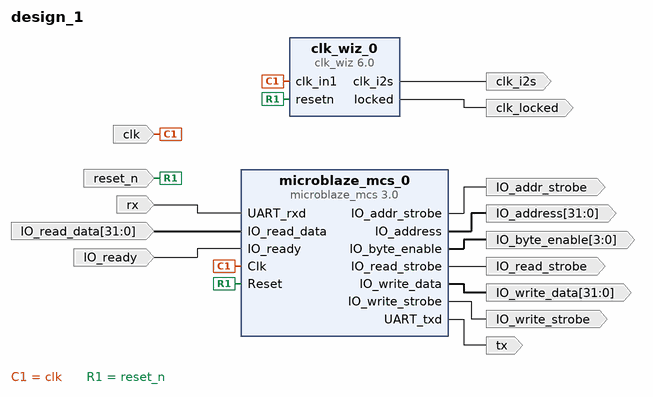
[diagram p0: block diagram of the top level]
# Vivado block design design_1, xc7a35ticsg324-1L, Vivado 2019.1
create_bd_design design_1

create_bd_port -dir I -type clk clk
set_property -dict {CONFIG.ASSOCIATED_RESET reset_n CONFIG.FREQ_HZ 100000000} [get_bd_ports clk]
create_bd_port -dir I -type rst reset_n
create_bd_port -dir I rx
create_bd_port -dir O tx
create_bd_port -dir O IO_addr_strobe
create_bd_port -dir O -from 31 -to 0 IO_address
create_bd_port -dir O -from 3 -to 0 IO_byte_enable
create_bd_port -dir I -from 31 -to 0 IO_read_data
create_bd_port -dir O IO_read_strobe
create_bd_port -dir I IO_ready
create_bd_port -dir O -from 31 -to 0 IO_write_data
create_bd_port -dir O IO_write_strobe
create_bd_port -dir O -type clk clk_i2s
set_property -dict {CONFIG.FREQ_HZ 12288135} [get_bd_ports clk_i2s]
create_bd_port -dir O clk_locked

create_bd_cell -type ip -vlnv xilinx.com:ip:microblaze_mcs:3.0 microblaze_mcs_0
set_property -dict [list \
  CONFIG.MEMSIZE 32768 \
  CONFIG.USE_IO_BUS 1 \
  CONFIG.USE_UART_RX 1 \
  CONFIG.USE_UART_TX 1 \
] [get_bd_cells microblaze_mcs_0]
create_bd_cell -type ip -vlnv xilinx.com:ip:clk_wiz:6.0 clk_wiz_0
set_property -dict [list \
  CONFIG.CLKOUT1_JITTER 190.154 \
  CONFIG.CLKOUT1_PHASE_ERROR 92.529 \
  CONFIG.CLKOUT1_REQUESTED_OUT_FREQ 12.288 \
  CONFIG.CLKOUT1_USED true \
  CONFIG.CLK_OUT1_PORT clk_i2s \
  CONFIG.JITTER_SEL Min_O_Jitter \
  CONFIG.MMCM_BANDWIDTH HIGH \
  CONFIG.MMCM_CLKFBOUT_MULT_F 10.875 \
  CONFIG.MMCM_CLKOUT0_DIVIDE_F 88.500 \
  CONFIG.MMCM_DIVCLK_DIVIDE 1 \
  CONFIG.RESET_PORT resetn \
  CONFIG.RESET_TYPE ACTIVE_LOW \
] [get_bd_cells clk_wiz_0]

# ---- connections ----

connect_bd_net -net microblaze_mcs_0_clk [get_bd_ports clk] [get_bd_pins microblaze_mcs_0/Clk] [get_bd_pins clk_wiz_0/clk_in1]
connect_bd_net -net microblaze_mcs_0_reset_n [get_bd_ports reset_n] [get_bd_pins microblaze_mcs_0/Reset] [get_bd_pins clk_wiz_0/resetn]
connect_bd_net -net microblaze_mcs_0_uart_rxd [get_bd_ports rx] [get_bd_pins microblaze_mcs_0/UART_rxd]
connect_bd_net [get_bd_pins microblaze_mcs_0/UART_txd] [get_bd_ports tx]
connect_bd_net [get_bd_pins microblaze_mcs_0/IO_addr_strobe] [get_bd_ports IO_addr_strobe]
connect_bd_net [get_bd_pins microblaze_mcs_0/IO_address] [get_bd_ports IO_address]
connect_bd_net [get_bd_pins microblaze_mcs_0/IO_byte_enable] [get_bd_ports IO_byte_enable]
connect_bd_net -net microblaze_mcs_0_IO_read_data [get_bd_ports IO_read_data] [get_bd_pins microblaze_mcs_0/IO_read_data]
connect_bd_net [get_bd_pins microblaze_mcs_0/IO_read_strobe] [get_bd_ports IO_read_strobe]
connect_bd_net -net microblaze_mcs_0_IO_ready [get_bd_ports IO_ready] [get_bd_pins microblaze_mcs_0/IO_ready]
connect_bd_net [get_bd_pins microblaze_mcs_0/IO_write_data] [get_bd_ports IO_write_data]
connect_bd_net [get_bd_pins microblaze_mcs_0/IO_write_strobe] [get_bd_ports IO_write_strobe]
connect_bd_net [get_bd_pins clk_wiz_0/clk_i2s] [get_bd_ports clk_i2s]
connect_bd_net [get_bd_pins clk_wiz_0/locked] [get_bd_ports clk_locked]

validate_bd_design
save_bd_design
